# EAGLE schematic M8317E (EAGLE 6.6.0)

## Sheet 1 of 2
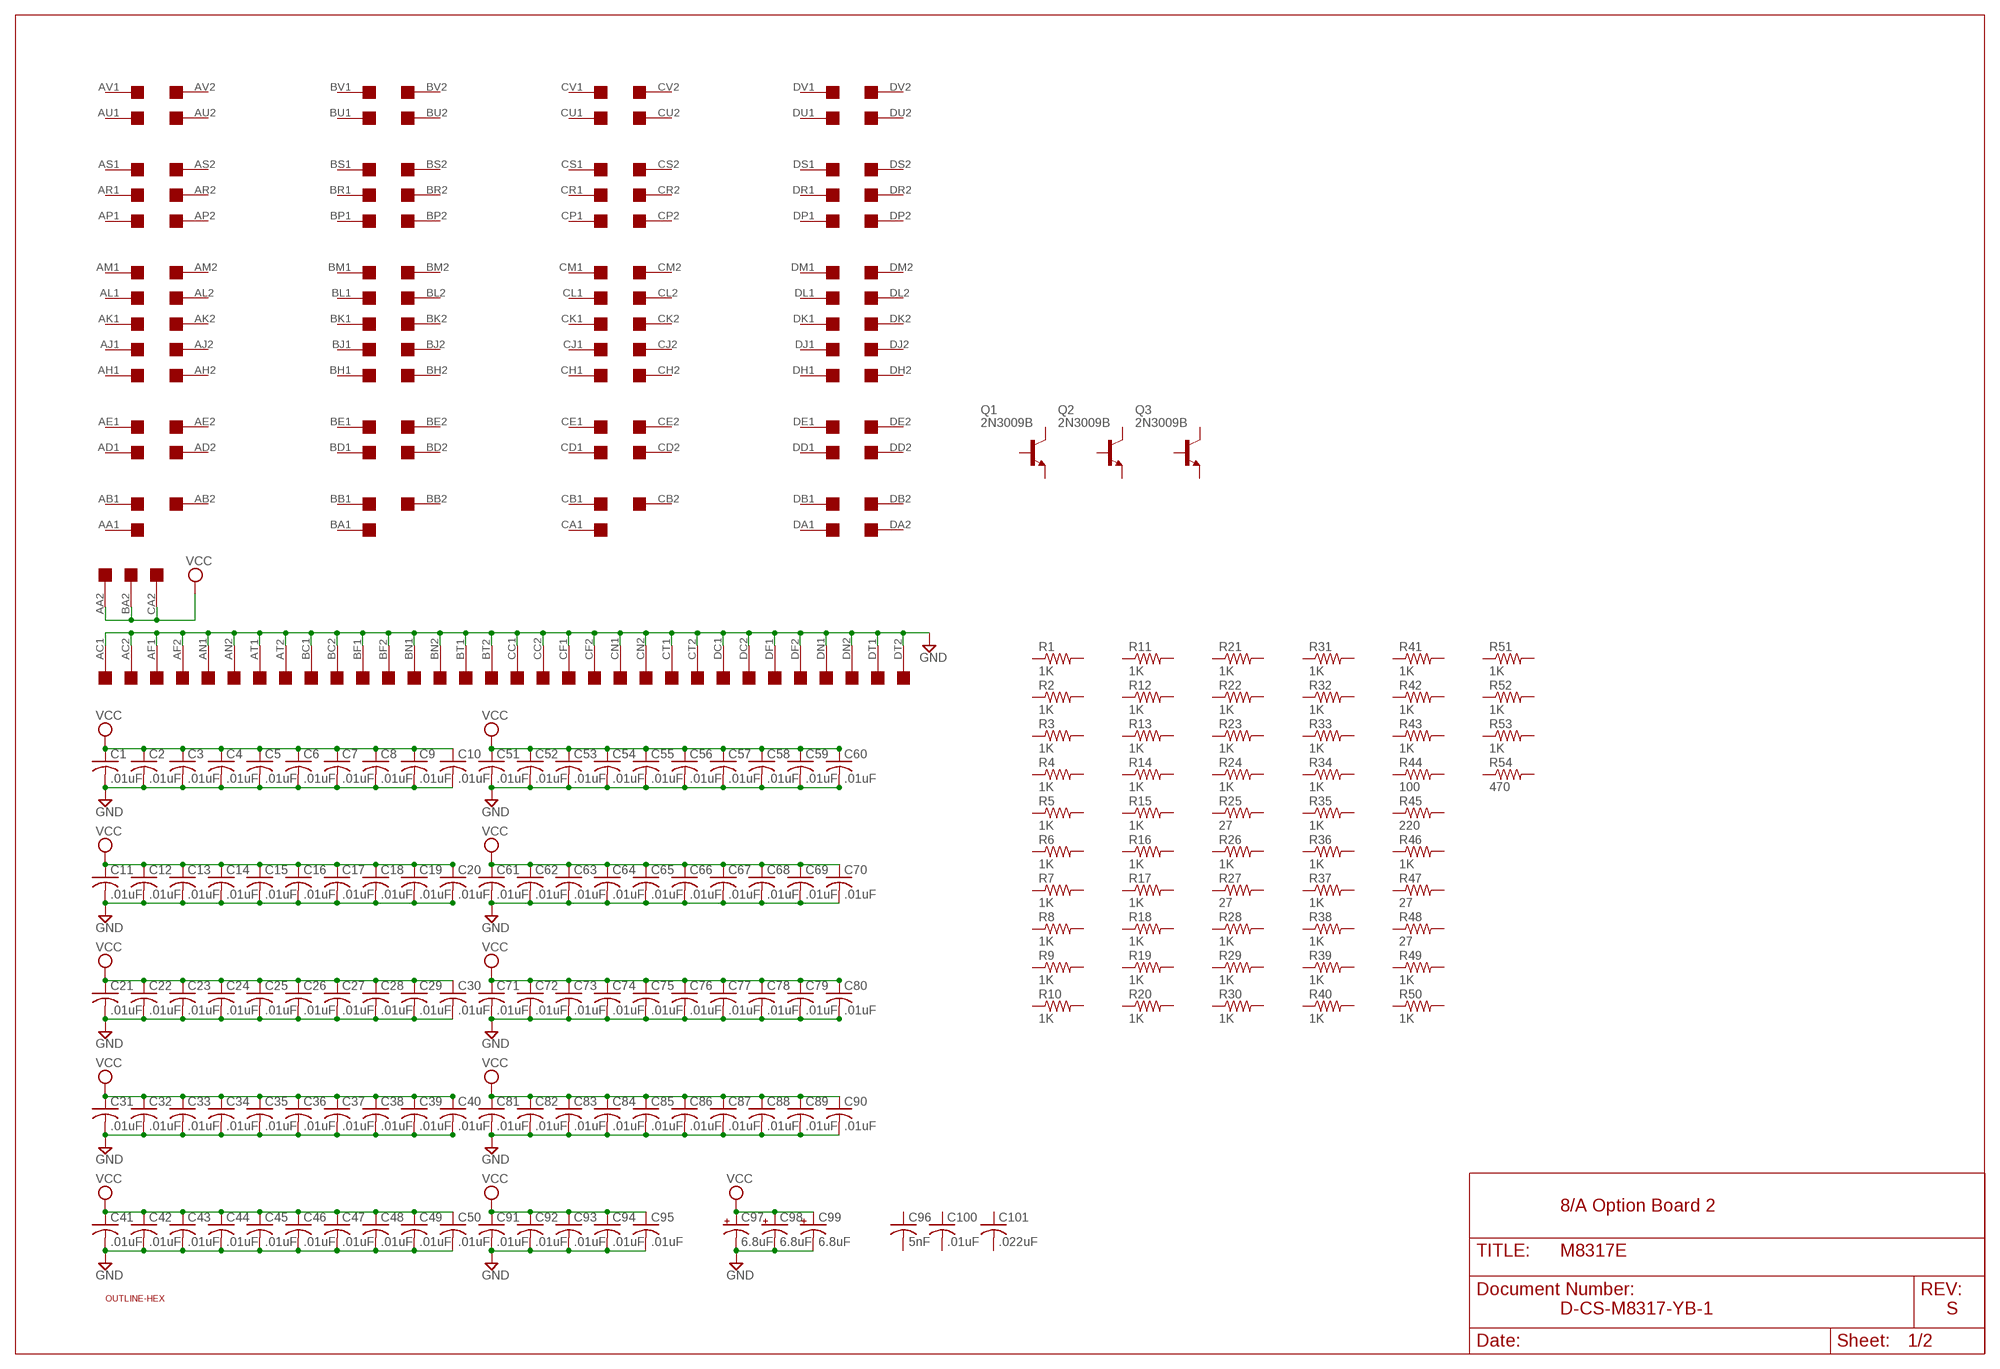
[diagram p0: schematic, sheet 1]

### Parts
C1  .01uF  C-US  [C063-025X075]
C2  .01uF  C-US  [C063-025X075]
C3  .01uF  C-US  [C063-025X075]
C4  .01uF  C-US  [C063-025X075]
C5  .01uF  C-US  [C063-025X075]
C6  .01uF  C-US  [C063-025X075]
C7  .01uF  C-US  [C063-025X075]
C8  .01uF  C-US  [C063-025X075]
C9  .01uF  C-US  [C063-025X075]
C10  .01uF  C-US  [C063-025X075]
C11  .01uF  C-US  [C063-025X075]
C12  .01uF  C-US  [C063-025X075]
C13  .01uF  C-US  [C063-025X075]
C14  .01uF  C-US  [C063-025X075]
C15  .01uF  C-US  [C063-025X075]
C16  .01uF  C-US  [C063-025X075]
C17  .01uF  C-US  [C063-025X075]
C18  .01uF  C-US  [C063-025X075]
C19  .01uF  C-US  [C063-025X075]
C20  .01uF  C-US  [C063-025X075]
C21  .01uF  C-US  [C063-025X075]
C22  .01uF  C-US  [C063-025X075]
C23  .01uF  C-US  [C063-025X075]
C24  .01uF  C-US  [C063-025X075]
C25  .01uF  C-US  [C063-025X075]
C26  .01uF  C-US  [C063-025X075]
C27  .01uF  C-US  [C063-025X075]
C28  .01uF  C-US  [C063-025X075]
C29  .01uF  C-US  [C063-025X075]
C30  .01uF  C-US  [C063-025X075]
C31  .01uF  C-US  [C063-025X075]
C32  .01uF  C-US  [C063-025X075]
C33  .01uF  C-US  [C063-025X075]
C34  .01uF  C-US  [C063-025X075]
C35  .01uF  C-US  [C063-025X075]
C36  .01uF  C-US  [C063-025X075]
C37  .01uF  C-US  [C063-025X075]
C38  .01uF  C-US  [C063-025X075]
C39  .01uF  C-US  [C063-025X075]
C40  .01uF  C-US  [C063-025X075]
C41  .01uF  C-US  [C063-025X075]
C42  .01uF  C-US  [C063-025X075]
C43  .01uF  C-US  [C063-025X075]
C44  .01uF  C-US  [C063-025X075]
C45  .01uF  C-US  [C063-025X075]
C46  .01uF  C-US  [C063-025X075]
C47  .01uF  C-US  [C063-025X075]
C48  .01uF  C-US  [C063-025X075]
C49  .01uF  C-US  [C063-025X075]
C50  .01uF  C-US  [C063-025X075]
C51  .01uF  C-US  [C063-025X075]
C52  .01uF  C-US  [C063-025X075]
C53  .01uF  C-US  [C063-025X075]
C54  .01uF  C-US  [C063-025X075]
C55  .01uF  C-US  [C063-025X075]
C56  .01uF  C-US  [C063-025X075]
C57  .01uF  C-US  [C063-025X075]
C58  .01uF  C-US  [C063-025X075]
C59  .01uF  C-US  [C063-025X075]
C60  .01uF  C-US  [C063-025X075]
C61  .01uF  C-US  [C063-025X075]
C62  .01uF  C-US  [C063-025X075]
C63  .01uF  C-US  [C063-025X075]
C64  .01uF  C-US  [C063-025X075]
C65  .01uF  C-US  [C063-025X075]
C66  .01uF  C-US  [C063-025X075]
C67  .01uF  C-US  [C063-025X075]
C68  .01uF  C-US  [C063-025X075]
C69  .01uF  C-US  [C063-025X075]
C70  .01uF  C-US  [C063-025X075]
C71  .01uF  C-US  [C063-025X075]
C72  .01uF  C-US  [C063-025X075]
C73  .01uF  C-US  [C063-025X075]
C74  .01uF  C-US  [C063-025X075]
C75  .01uF  C-US  [C063-025X075]
C76  .01uF  C-US  [C063-025X075]
C77  .01uF  C-US  [C063-025X075]
C78  .01uF  C-US  [C063-025X075]
C79  .01uF  C-US  [C063-025X075]
C80  .01uF  C-US  [C063-025X075]
C81  .01uF  C-US  [C063-025X075]
C82  .01uF  C-US  [C063-025X075]
C83  .01uF  C-US  [C063-025X075]
C84  .01uF  C-US  [C063-025X075]
C85  .01uF  C-US  [C063-025X075]
C86  .01uF  C-US  [C063-025X075]
C87  .01uF  C-US  [C063-025X075]
C88  .01uF  C-US  [C063-025X075]
C89  .01uF  C-US  [C063-025X075]
C90  .01uF  C-US  [C063-025X075]
C91  .01uF  C-US  [C063-025X075]
C92  .01uF  C-US  [C063-025X075]
C93  .01uF  C-US  [C063-025X075]
C94  .01uF  C-US  [C063-025X075]
C95  .01uF  C-US  [C063-025X075]
C96  5nF  C-US  [C063-025X075]
C97  6.8uF  CPOL-USE20-8AXIAL  [E12-8]
C98  6.8uF  CPOL-USE20-8AXIAL  [E12-8]
C99  6.8uF  CPOL-USE20-8AXIAL  [E12-8]
C100  .01uF  C-US  [C063-025X075]
C101  .022uF  C-US  [C063-025X075]
Q1  2N3009B  -NPN-TO5  [TO5]
Q2  2N3009B  -NPN-TO5  [TO5]
Q3  2N3009B  -NPN-TO5  [TO5]
R1  1K  R-US_0207/10  [0207/10]
R2  1K  R-US_0207/10  [0207/10]
R3  1K  R-US_0207/10  [0207/10]
R4  1K  R-US_0207/10  [0207/10]
R5  1K  R-US_0207/10  [0207/10]
R6  1K  R-US_0207/10  [0207/10]
R7  1K  R-US_0207/10  [0207/10]
R8  1K  R-US_0207/10  [0207/10]
R9  1K  R-US_0207/10  [0207/10]
R10  1K  R-US_0207/10  [0207/10]
R11  1K  R-US_0207/10  [0207/10]
R12  1K  R-US_0207/10  [0207/10]
R13  1K  R-US_0207/10  [0207/10]
R14  1K  R-US_0207/10  [0207/10]
R15  1K  R-US_0207/10  [0207/10]
R16  1K  R-US_0207/10  [0207/10]
R17  1K  R-US_0207/10  [0207/10]
R18  1K  R-US_0207/10  [0207/10]
R19  1K  R-US_0207/10  [0207/10]
R20  1K  R-US_0207/10  [0207/10]
R21  1K  R-US_0207/10  [0207/10]
R22  1K  R-US_0207/10  [0207/10]
R23  1K  R-US_0207/10  [0207/10]
R24  1K  R-US_0207/10  [0207/10]
R25  27  R-US_0207/10  [0207/10]
R26  1K  R-US_0207/10  [0207/10]
R27  27  R-US_0207/10  [0207/10]
R28  1K  R-US_0207/10  [0207/10]
R29  1K  R-US_0207/10  [0207/10]
R30  1K  R-US_0207/10  [0207/10]
R31  1K  R-US_0207/10  [0207/10]
R32  1K  R-US_0207/10  [0207/10]
R33  1K  R-US_0207/10  [0207/10]
R34  1K  R-US_0207/10  [0207/10]
R35  1K  R-US_0207/10  [0207/10]
R36  1K  R-US_0207/10  [0207/10]
R37  1K  R-US_0207/10  [0207/10]
R38  1K  R-US_0207/10  [0207/10]
R39  1K  R-US_0207/10  [0207/10]
R40  1K  R-US_0207/10  [0207/10]
R41  1K  R-US_0207/10  [0207/10]
R42  1K  R-US_0207/10  [0207/10]
R43  1K  R-US_0207/10  [0207/10]
R44  100  R-US_0207/10  [0207/10]
R45  220  R-US_0207/10  [0207/10]
R46  1K  R-US_0207/10  [0207/10]
R47  27  R-US_0207/10  [0207/10]
R48  27  R-US_0207/10  [0207/10]
R49  1K  R-US_0207/10  [0207/10]
R50  1K  R-US_0207/10  [0207/10]
R51  1K  R-US_0207/10  [0207/10]
R52  1K  R-US_0207/10  [0207/10]
R53  1K  R-US_0207/10  [0207/10]
R54  470  R-US_0207/10  [0207/10]
U$1  HEX  [EDGE-CON12]
U$2  OUTLINE-HEX  [HEX-HEIGHT]

### Nets
GND: C1.2 C2.2 C3.2 C4.2 C5.2 C6.2 C7.2 C8.2 C9.2 C10.2 C11.2 C12.2 C13.2 C14.2 C15.2 C16.2 C17.2 C18.2 C19.2 C20.2 C21.2 C22.2 C23.2 C24.2 C25.2 C26.2 C27.2 C28.2 C29.2 C30.2 C31.2 C32.2 C33.2 C34.2 C35.2 C36.2 C37.2 C38.2 C39.2 C40.2 C41.2 C42.2 C43.2 C44.2 C45.2 C46.2 C47.2 C48.2 C49.2 C50.2 C51.2 C52.2 C53.2 C54.2 C55.2 C56.2 C57.2 C58.2 C59.2 C60.2 C61.2 C62.2 C63.2 C64.2 C65.2 C66.2 C67.2 C68.2 C69.2 C70.2 C71.2 C72.2 C73.2 C74.2 C75.2 C76.2 C77.2 C78.2 C79.2 C80.2 C81.2 C82.2 C83.2 C84.2 C85.2 C86.2 C87.2 C88.2 C89.2 C90.2 C91.2 C92.2 C93.2 C94.2 C95.2 C97.- C98.- C99.- U$1.AC1 U$1.AC2 U$1.AF1 U$1.AF2 U$1.AN1 U$1.AN2 U$1.AT1 U$1.AT2 U$1.BC1 U$1.BC2 U$1.BF1 U$1.BF2 U$1.BN1 U$1.BN2 U$1.BT1 U$1.BT2 U$1.CC1 U$1.CC2 U$1.CF1 U$1.CF2 U$1.CN1 U$1.CN2 U$1.CT1 U$1.CT2 U$1.DC1 U$1.DC2 U$1.DF1 U$1.DF2 U$1.DN1 U$1.DN2 U$1.DT1 U$1.DT2
VCC: C1.1 C2.1 C3.1 C4.1 C5.1 C6.1 C7.1 C8.1 C9.1 C10.1 C11.1 C12.1 C13.1 C14.1 C15.1 C16.1 C17.1 C18.1 C19.1 C20.1 C21.1 C22.1 C23.1 C24.1 C25.1 C26.1 C27.1 C28.1 C29.1 C30.1 C31.1 C32.1 C33.1 C34.1 C35.1 C36.1 C37.1 C38.1 C39.1 C40.1 C41.1 C42.1 C43.1 C44.1 C45.1 C46.1 C47.1 C48.1 C49.1 C50.1 C51.1 C52.1 C53.1 C54.1 C55.1 C56.1 C57.1 C58.1 C59.1 C60.1 C61.1 C62.1 C63.1 C64.1 C65.1 C66.1 C67.1 C68.1 C69.1 C70.1 C71.1 C72.1 C73.1 C74.1 C75.1 C76.1 C77.1 C78.1 C79.1 C80.1 C81.1 C82.1 C83.1 C84.1 C85.1 C86.1 C87.1 C88.1 C89.1 C90.1 C91.1 C92.1 C93.1 C94.1 C95.1 C97.+ C98.+ C99.+ U$1.AA2 U$1.BA2 U$1.CA2
Unconnected: C96.1 C96.2 C100.1 C100.2 C101.1 C101.2 Q1.1(E) Q1.2(B) Q1.3(C) Q2.1(E) Q2.2(B) Q2.3(C) Q3.1(E) Q3.2(B) Q3.3(C) R1.1 R1.2 R2.1 R2.2 R3.1 R3.2 R4.1 R4.2 R5.1 R5.2 R6.1 R6.2 R7.1 R7.2 R8.1 R8.2 R9.1 R9.2 R10.1 R10.2 R11.1 R11.2 R12.1 R12.2 R13.1 R13.2 R14.1 R14.2 R15.1 R15.2 R16.1 R16.2 R17.1 R17.2 R18.1 R18.2 R19.1 R19.2 R20.1 R20.2 R21.1 R21.2 R22.1 R22.2 R23.1 R23.2 R24.1 R24.2 R25.1 R25.2 R26.1 R26.2 R27.1 R27.2 R28.1 R28.2 R29.1 R29.2 R30.1 R30.2 R31.1 R31.2 R32.1 R32.2 R33.1 R33.2 R34.1 R34.2 R35.1 R35.2 R36.1 R36.2 R37.1 R37.2 R38.1 R38.2 R39.1 R39.2 R40.1 R40.2 R41.1 R41.2 R42.1 R42.2 R43.1 R43.2 R44.1 R44.2 R45.1 R45.2 R46.1 R46.2 R47.1 R47.2 R48.1 R48.2 R49.1 R49.2 R50.1 R50.2 R51.1 R51.2 R52.1 R52.2 R53.1 R53.2 R54.1 R54.2 U$1.AA1 U$1.AB1 U$1.AB2 U$1.AD1 U$1.AD2 U$1.AE1 U$1.AE2 U$1.AH1 U$1.AH2 U$1.AJ1 U$1.AJ2 U$1.AK1 U$1.AK2 U$1.AL1 U$1.AL2 U$1.AM1 U$1.AM2 U$1.AP1 U$1.AP2 U$1.AR1 U$1.AR2 U$1.AS1 U$1.AS2 U$1.AU1 U$1.AU2 U$1.AV1 U$1.AV2 U$1.BA1 U$1.BB1 U$1.BB2 U$1.BD1 U$1.BD2 U$1.BE1 U$1.BE2 U$1.BH1 U$1.BH2 U$1.BJ1 U$1.BJ2 U$1.BK1 U$1.BK2 U$1.BL1 U$1.BL2 U$1.BM1 U$1.BM2 U$1.BP1 U$1.BP2 U$1.BR1 U$1.BR2 U$1.BS1 U$1.BS2 U$1.BU1 U$1.BU2 U$1.BV1 U$1.BV2 U$1.CA1 U$1.CB1 U$1.CB2 U$1.CD1 U$1.CD2 U$1.CE1 U$1.CE2 U$1.CH1 U$1.CH2 U$1.CJ1 U$1.CJ2 U$1.CK1 U$1.CK2 U$1.CL1 U$1.CL2 U$1.CM1 U$1.CM2 U$1.CP1 U$1.CP2 U$1.CR1 U$1.CR2 U$1.CS1 U$1.CS2 U$1.CU1 U$1.CU2 U$1.CV1 U$1.CV2 U$1.DA1 U$1.DA2 U$1.DB1 U$1.DB2 U$1.DD1 U$1.DD2 U$1.DE1 U$1.DE2 U$1.DH1 U$1.DH2 U$1.DJ1 U$1.DJ2 U$1.DK1 U$1.DK2 U$1.DL1 U$1.DL2 U$1.DM1 U$1.DM2 U$1.DP1 U$1.DP2 U$1.DR1 U$1.DR2 U$1.DS1 U$1.DS2 U$1.DU1 U$1.DU2 U$1.DV1 U$1.DV2 U$1.EA1 U$1.EA2 U$1.EB1 U$1.EB2 U$1.EC1 U$1.EC2 U$1.ED1 U$1.ED2 U$1.EE1 U$1.EE2 U$1.EF1 U$1.EF2 U$1.EH1 U$1.EH2 U$1.EJ1 U$1.EJ2 U$1.EK1 U$1.EK2 U$1.EL1 U$1.EL2 U$1.EM1 U$1.EM2 U$1.EN1 U$1.EN2 U$1.EP1 U$1.EP2 U$1.ER1 U$1.ER2 U$1.ES1 U$1.ES2 U$1.ET1 U$1.ET2 U$1.EU1 U$1.EU2 U$1.EV1 U$1.EV2 U$1.FA1 U$1.FA2 U$1.FB1 U$1.FB2 U$1.FC1 U$1.FC2 U$1.FD1 U$1.FD2 U$1.FE1 U$1.FE2 U$1.FF1 U$1.FF2 U$1.FH1 U$1.FH2 U$1.FJ1 U$1.FJ2 U$1.FK1 U$1.FK2 U$1.FL1 U$1.FL2 U$1.FM1 U$1.FM2 U$1.FN1 U$1.FN2 U$1.FP1 U$1.FP2 U$1.FR1 U$1.FR2 U$1.FS1 U$1.FS2 U$1.FT1 U$1.FT2 U$1.FU1 U$1.FU2 U$1.FV1 U$1.FV2

### Notes on the sheet
- 8/A Option Board 2
- D-CS-M8317-YB-1 | S

## Sheet 2 of 2
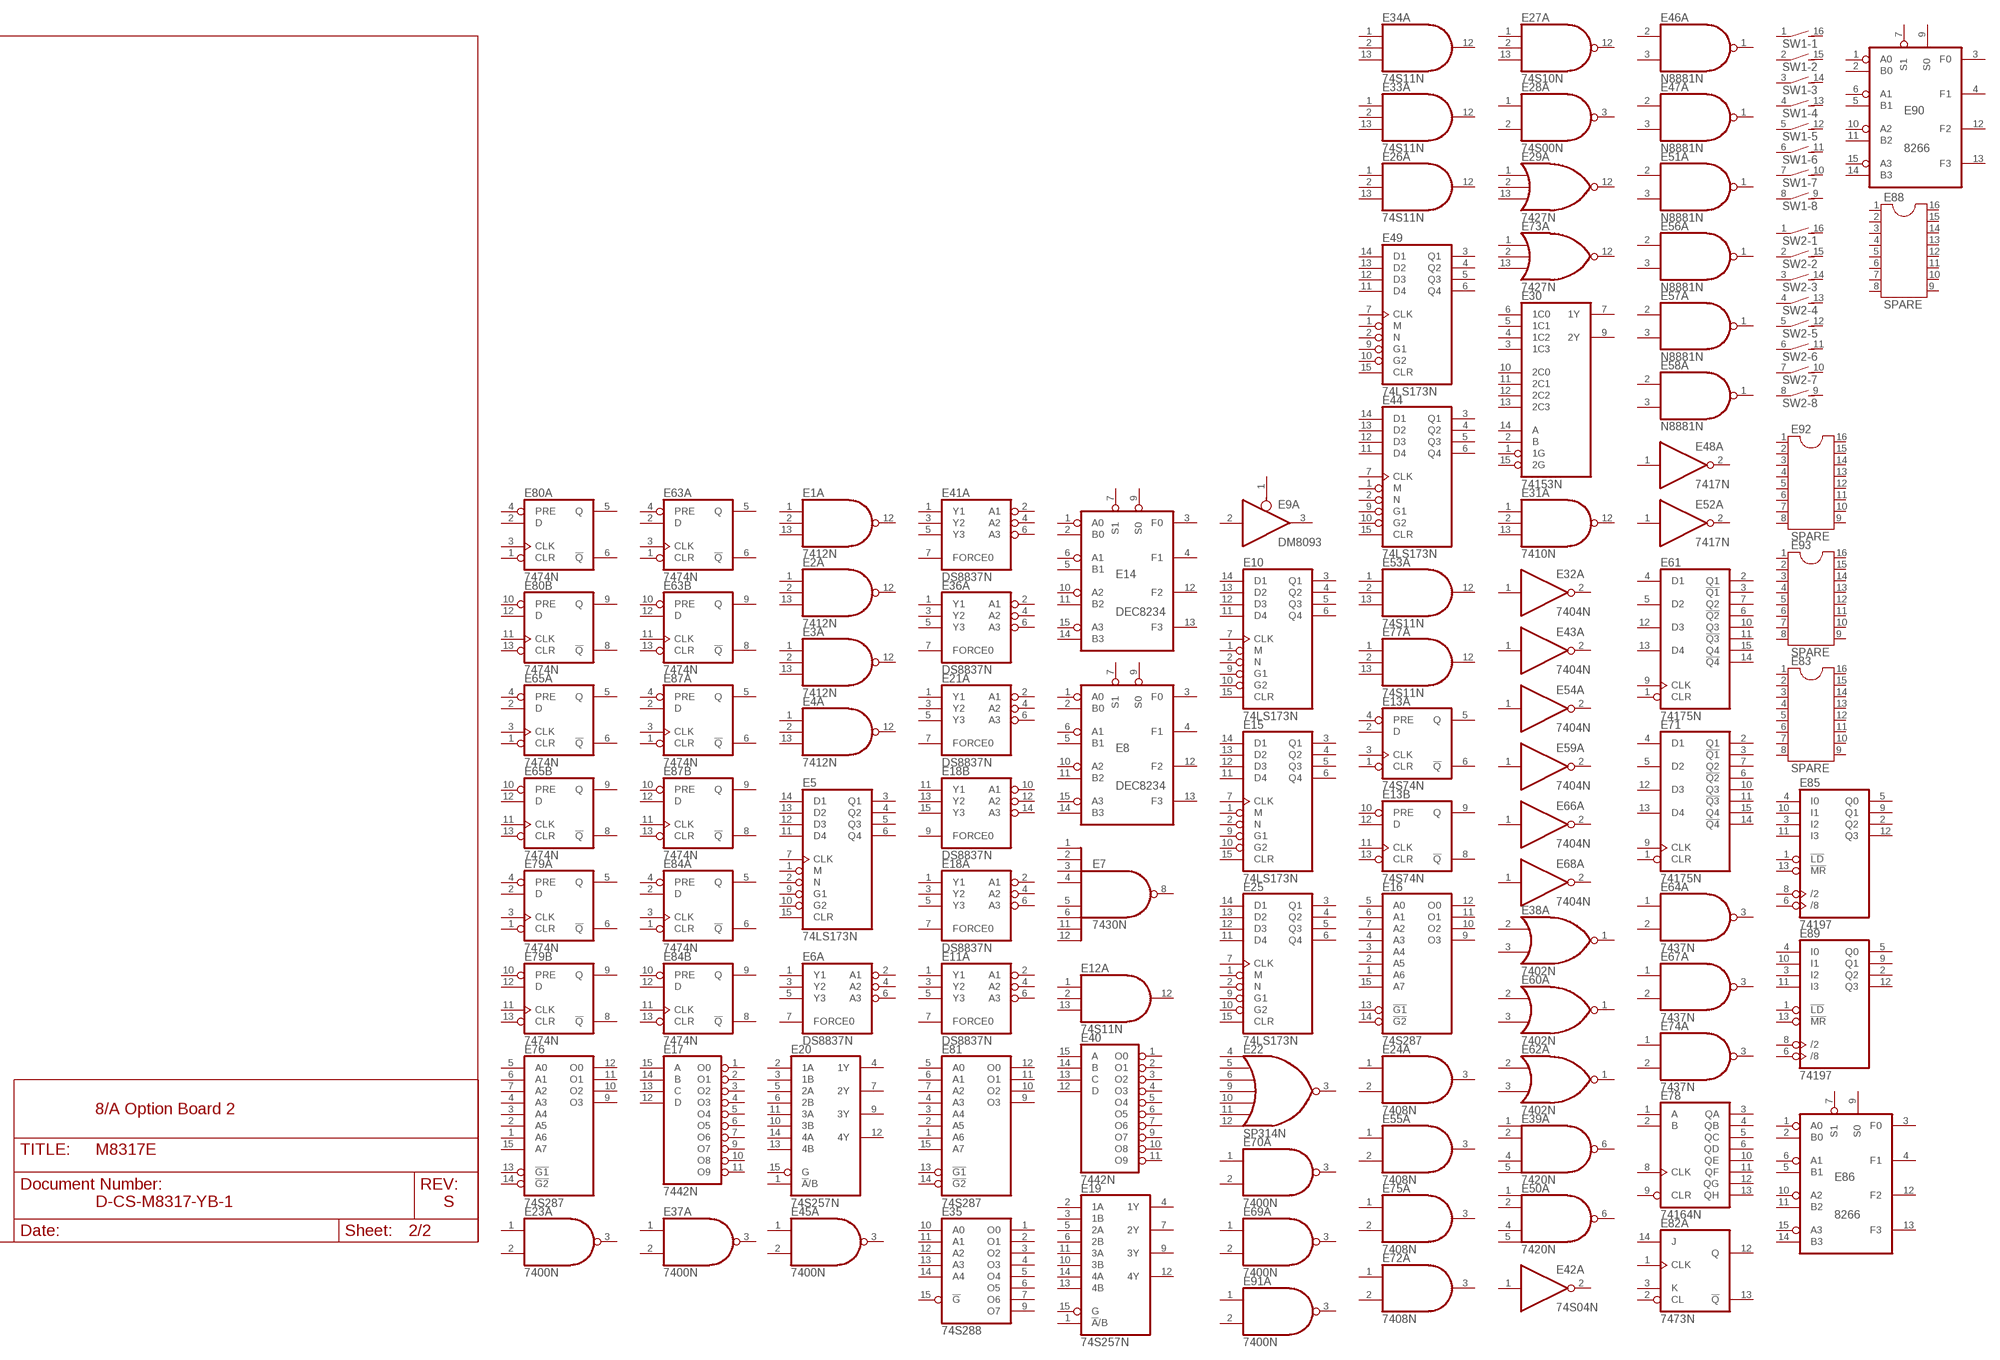
[diagram p1: schematic, sheet 2]

### Parts
E1  7412N  [DIL14]
E2  7412N  [DIL14]
E3  7412N  [DIL14]
E4  7412N  [DIL14]
E5  74LS173N  [DIL16]
E6  DS8837N  [DIL16]
E7  7430N  [DIL14]
E8  DEC8234  DEC8235  [DIL16]
E9  DM8093  74125N  [DIL14]
E10  74LS173N  [DIL16]
E11  DS8837N  [DIL16]
E12  74S11N  [DIL14]
E13  74S74N  [DIL14]
E14  DEC8234  DEC8235  [DIL16]
E15  74LS173N  [DIL16]
E16  74S287  [DIL16]
E17  7442N  74LS42N  [DIL16]
E18  DS8837N  [DIL16]
E19  74S257N  [DIL16]
E20  74S257N  [DIL16]
E21  DS8837N  [DIL16]
E22  SP314N  [DIL14]
E23  7400N  [DIL14]
E24  7408N  74S08N  [DIL14]
E25  74LS173N  [DIL16]
E26  74S11N  [DIL14]
E27  74S10N  [DIL14]
E28  74S00N  7400N  [DIL14]
E29  7427N  74LS27N  [DIL14]
E30  74153N  74S153N  [DIL16]
E31  7410N  74S10N  [DIL14]
E32  7404N  [DIL14]
E33  74S11N  [DIL14]
E34  74S11N  [DIL14]
E35  74S288  [DIL16]
E36  DS8837N  [DIL16]
E37  7400N  [DIL14]
E38  7402N  [DIL14]
E39  7420N  [DIL14]
E40  7442N  74LS42N  [DIL16]
E41  DS8837N  [DIL16]
E42  74S04N  7404N  [DIL14]
E43  7404N  [DIL14]
E44  74LS173N  [DIL16]
E45  7400N  [DIL14]
E46  N8881N  [DIL14]
E47  N8881N  [DIL14]
E48  7417N  [DIL14]
E49  74LS173N  [DIL16]
E50  7420N  [DIL14]
E51  N8881N  [DIL14]
E52  7417N  [DIL14]
E53  74S11N  [DIL14]
E54  7404N  [DIL14]
E55  7408N  74S08N  [DIL14]
E56  N8881N  [DIL14]
E57  N8881N  [DIL14]
E58  N8881N  [DIL14]
E59  7404N  [DIL14]
E60  7402N  [DIL14]
E61  74175N  [DIL16]
E62  7402N  [DIL14]
E63  7474N  74S74N  [DIL14]
E64  7437N  [DIL14]
E65  7474N  74S74N  [DIL14]
E66  7404N  [DIL14]
E67  7437N  [DIL14]
E68  7404N  [DIL14]
E69  7400N  [DIL14]
E70  7400N  [DIL14]
E71  74175N  [DIL16]
E72  7408N  74S08N  [DIL14]
E73  7427N  74LS27N  [DIL14]
E74  7437N  [DIL14]
E75  7408N  74S08N  [DIL14]
E76  74S287  [DIL16]
E77  74S11N  [DIL14]
E78  74164N  [DIL14]
E79  7474N  74S74N  [DIL14]
E80  7474N  74S74N  [DIL14]
E81  74S287  [DIL16]
E82  7473N  74LS73N  [DIL14]
E83  SPARE  DIL16S  [SOCKET-16]
E84  7474N  74S74N  [DIL14]
E85  74197  74LS197  [DIL14]
E86  8266  [DIL16]
E87  7474N  74S74N  [DIL14]
E88  SPARE  DIL16S  [SOCKET-16]
E89  74197  74LS197  [DIL14]
E90  8266  [DIL16]
E91  7400N  [DIL14]
E92  SPARE  DIL16S  [SOCKET-16]
E93  SPARE  DIL16S  [SOCKET-16]
SW1  DIP08S  [DIP08S]
SW2  DIP08S  [DIP08S]
Unconnected: E1.1(A:I0) E1.2(A:I1) E1.3(B:I0) E1.4(B:I1) E1.5(B:I2) E1.6(B:O) E1.8(C:O) E1.9(C:I0) E1.10(C:I1) E1.11(C:I2) E1.12(A:O) E1.13(A:I2) E2.1(A:I0) E2.2(A:I1) E2.3(B:I0) E2.4(B:I1) E2.5(B:I2) E2.6(B:O) E2.8(C:O) E2.9(C:I0) E2.10(C:I1) E2.11(C:I2) E2.12(A:O) E2.13(A:I2) E3.1(A:I0) E3.2(A:I1) E3.3(B:I0) E3.4(B:I1) E3.5(B:I2) E3.6(B:O) E3.8(C:O) E3.9(C:I0) E3.10(C:I1) E3.11(C:I2) E3.12(A:O) E3.13(A:I2) E4.1(A:I0) E4.2(A:I1) E4.3(B:I0) E4.4(B:I1) E4.5(B:I2) E4.6(B:O) E4.8(C:O) E4.9(C:I0) E4.10(C:I1) E4.11(C:I2) E4.12(A:O) E4.13(A:I2) E5.1(M) E5.2(N) E5.3(Q1) E5.4(Q2) E5.5(Q3) E5.6(Q4) E5.7(CLK) E5.9(G1) E5.10(G2) E5.11(D4) E5.12(D3) E5.13(D2) E5.14(D1) E5.15(CLR) E6.1(A:Y1) E6.2(A:A1) E6.3(A:Y2) E6.4(A:A2) E6.5(A:Y3) E6.6(A:A3) E6.7(A:FORCE0) E6.9(B:FORCE0) E6.10(B:A1) E6.11(B:Y1) E6.12(B:A2) E6.13(B:Y2) E6.14(B:A3) E6.15(B:Y3) E7.1(I0) E7.2(I1) E7.3(I2) E7.4(I3) E7.5(I4) E7.6(I5) E7.8(O) E7.9(P) E7.10(P) E7.11(I6) E7.12(I7) E7.13(P) E8.1(A0) E8.2(B0) E8.3(F0) E8.4(F1) E8.5(B1) E8.6(A1) E8.7(S1) E8.9(S0) E8.10(A2) E8.11(B2) E8.12(F2) E8.13(F3) E8.14(B3) E8.15(A3) E9.1(A:OE) E9.2(A:I) E9.3(A:O) E9.4(B:OE) E9.5(B:I) E9.6(B:O) E9.8(C:O) E9.9(C:I) E9.10(C:OE) E9.11(D:O) E9.12(D:I) E9.13(D:OE) E10.1(M) E10.2(N) E10.3(Q1) E10.4(Q2) E10.5(Q3) E10.6(Q4) E10.7(CLK) E10.9(G1) E10.10(G2) E10.11(D4) E10.12(D3) E10.13(D2) E10.14(D1) E10.15(CLR) E11.1(A:Y1) E11.2(A:A1) E11.3(A:Y2) E11.4(A:A2) E11.5(A:Y3) E11.6(A:A3) E11.7(A:FORCE0) E11.9(B:FORCE0) E11.10(B:A1) E11.11(B:Y1) E11.12(B:A2) E11.13(B:Y2) E11.14(B:A3) E11.15(B:Y3) E12.1(A:I0) E12.2(A:I1) E12.3(B:I0) E12.4(B:I1) E12.5(B:I2) E12.6(B:O) E12.8(C:O) E12.9(C:I0) E12.10(C:I1) E12.11(C:I2) E12.12(A:O) E12.13(A:I2) E13.1(A:CLR) E13.2(A:D) E13.3(A:CLK) E13.4(A:PRE) E13.5(A:Q) E13.6(A:!Q) E13.8(B:!Q) E13.9(B:Q) E13.10(B:PRE) E13.11(B:CLK) E13.12(B:D) E13.13(B:CLR) E14.1(A0) E14.2(B0) E14.3(F0) E14.4(F1) E14.5(B1) E14.6(A1) E14.7(S1) E14.9(S0) E14.10(A2) E14.11(B2) E14.12(F2) E14.13(F3) E14.14(B3) E14.15(A3) E15.1(M) E15.2(N) E15.3(Q1) E15.4(Q2) E15.5(Q3) E15.6(Q4) E15.7(CLK) E15.9(G1) E15.10(G2) E15.11(D4) E15.12(D3) E15.13(D2) E15.14(D1) E15.15(CLR) E16.1(A6) E16.2(A5) E16.3(A4) E16.4(A3) E16.5(A0) E16.6(A1) E16.7(A2) E16.9(O3) E16.10(O2) E16.11(O1) E16.12(O0) E16.13(!G1) E16.14(!G2) E16.15(A7) E17.1(O0) E17.2(O1) E17.3(O2) E17.4(O3) E17.5(O4) E17.6(O5) E17.7(O6) E17.9(O7) E17.10(O8) E17.11(O9) E17.12(D) E17.13(C) E17.14(B) E17.15(A) E18.1(A:Y1) E18.2(A:A1) E18.3(A:Y2) E18.4(A:A2) E18.5(A:Y3) E18.6(A:A3) E18.7(A:FORCE0) E18.9(B:FORCE0) E18.10(B:A1) E18.11(B:Y1) E18.12(B:A2) E18.13(B:Y2) E18.14(B:A3) E18.15(B:Y3) E19.1(!A!/B) E19.2(1A) E19.3(1B) E19.4(1Y) E19.5(2A) E19.6(2B) E19.7(2Y) E19.9(3Y) E19.10(3B) E19.11(3A) E19.12(4Y) E19.13(4B) E19.14(4A) E19.15(G) E20.1(!A!/B) E20.2(1A) E20.3(1B) E20.4(1Y) E20.5(2A) E20.6(2B) E20.7(2Y) E20.9(3Y) E20.10(3B) E20.11(3A) E20.12(4Y) E20.13(4B) E20.14(4A) E20.15(G) E21.1(A:Y1) E21.2(A:A1) E21.3(A:Y2) E21.4(A:A2) E21.5(A:Y3) E21.6(A:A3) E21.7(A:FORCE0) E21.9(B:FORCE0) E21.10(B:A1) E21.11(B:Y1) E21.12(B:A2) E21.13(B:Y2) E21.14(B:A3) E21.15(B:Y3) E22.3(O) E22.4(I0) E22.5(I1) E22.6(I2) E22.9(I3) E22.10(I4) E22.11(I5) E22.12(I6) E23.1(A:I0) E23.2(A:I1) E23.3(A:O) E23.4(B:I0) E23.5(B:I1) E23.6(B:O) E23.8(C:O) E23.9(C:I0) E23.10(C:I1) E23.11(D:O) E23.12(D:I0) E23.13(D:I1) E24.1(A:I0) E24.2(A:I1) E24.3(A:O) E24.4(B:I0) E24.5(B:I1) E24.6(B:O) E24.8(C:O) E24.9(C:I0) E24.10(C:I1) E24.11(D:O) E24.12(D:I0) E24.13(D:I1) E25.1(M) E25.2(N) E25.3(Q1) E25.4(Q2) E25.5(Q3) E25.6(Q4) E25.7(CLK) E25.9(G1) E25.10(G2) E25.11(D4) E25.12(D3) E25.13(D2) E25.14(D1) E25.15(CLR) E26.1(A:I0) E26.2(A:I1) E26.3(B:I0) E26.4(B:I1) E26.5(B:I2) E26.6(B:O) E26.8(C:O) E26.9(C:I0) E26.10(C:I1) E26.11(C:I2) E26.12(A:O) E26.13(A:I2) E27.1(A:I0) E27.2(A:I1) E27.3(B:I0) E27.4(B:I1) E27.5(B:I2) E27.6(B:O) E27.8(C:O) E27.9(C:I0) E27.10(C:I1) E27.11(C:I2) E27.12(A:O) E27.13(A:I2) E28.1(A:I0) E28.2(A:I1) E28.3(A:O) E28.4(B:I0) E28.5(B:I1) E28.6(B:O) E28.8(C:O) E28.9(C:I0) E28.10(C:I1) E28.11(D:O) E28.12(D:I0) E28.13(D:I1) E29.1(A:I0) E29.2(A:I1) E29.3(B:I0) E29.4(B:I1) E29.5(B:I2) E29.6(B:O) E29.8(C:O) E29.9(C:I0) E29.10(C:I1) E29.11(C:I2) E29.12(A:O) E29.13(A:I2) E30.1(1G) E30.2(B) E30.3(1C3) E30.4(1C2) E30.5(1C1) E30.6(1C0) E30.7(1Y) E30.9(2Y) E30.10(2C0) E30.11(2C1) E30.12(2C2) E30.13(2C3) E30.14(A) E30.15(2G) E31.1(A:I0) E31.2(A:I1) E31.3(B:I0) E31.4(B:I1) E31.5(B:I2) E31.6(B:O) E31.8(C:O) E31.9(C:I0) E31.10(C:I1) E31.11(C:I2) E31.12(A:O) E31.13(A:I2) E32.1(A:I) E32.2(A:O) E32.3(B:I) E32.4(B:O) E32.5(C:I) E32.6(C:O) E32.8(D:O) E32.9(D:I) E32.10(E:O) E32.11(E:I) E32.12(F:O) E32.13(F:I) E33.1(A:I0) E33.2(A:I1) E33.3(B:I0) E33.4(B:I1) E33.5(B:I2) E33.6(B:O) E33.8(C:O) E33.9(C:I0) E33.10(C:I1) E33.11(C:I2) E33.12(A:O) E33.13(A:I2) E34.1(A:I0) E34.2(A:I1) E34.3(B:I0) E34.4(B:I1) E34.5(B:I2) E34.6(B:O) E34.8(C:O) E34.9(C:I0) E34.10(C:I1) E34.11(C:I2) E34.12(A:O) E34.13(A:I2) E35.1(O0) E35.2(O1) E35.3(O2) E35.4(O3) E35.5(O4) E35.6(O5) E35.7(O6) E35.9(O7) E35.10(A0) E35.11(A1) E35.12(A2) E35.13(A3) E35.14(A4) E35.15(!G) E36.1(A:Y1) E36.2(A:A1) E36.3(A:Y2) E36.4(A:A2) E36.5(A:Y3) E36.6(A:A3) E36.7(A:FORCE0) E36.9(B:FORCE0) E36.10(B:A1) E36.11(B:Y1) E36.12(B:A2) E36.13(B:Y2) E36.14(B:A3) E36.15(B:Y3) E37.1(A:I0) E37.2(A:I1) E37.3(A:O) E37.4(B:I0) E37.5(B:I1) E37.6(B:O) E37.8(C:O) E37.9(C:I0) E37.10(C:I1) E37.11(D:O) E37.12(D:I0) E37.13(D:I1) E38.1(A:O) E38.2(A:I0) E38.3(A:I1) E38.4(B:O) E38.5(B:I0) E38.6(B:I1) E38.8(C:I0) E38.9(C:I1) E38.10(C:O) E38.11(D:I0) E38.12(D:I1) E38.13(D:O) E39.1(A:I0) E39.2(A:I1) E39.3(3:NC) E39.4(A:I2) E39.5(A:I3) E39.6(A:O) E39.8(B:O) E39.9(B:I0) E39.10(B:I1) E39.11(11:NC) E39.12(B:I2) E39.13(B:I3) E40.1(O0) E40.2(O1) E40.3(O2) E40.4(O3) E40.5(O4) E40.6(O5) E40.7(O6) E40.9(O7) E40.10(O8) E40.11(O9) E40.12(D) E40.13(C) E40.14(B) E40.15(A) E41.1(A:Y1) E41.2(A:A1) E41.3(A:Y2) E41.4(A:A2) E41.5(A:Y3) E41.6(A:A3) E41.7(A:FORCE0) E41.9(B:FORCE0) E41.10(B:A1) E41.11(B:Y1) E41.12(B:A2) E41.13(B:Y2) E41.14(B:A3) E41.15(B:Y3) E42.1(A:I) E42.2(A:O) E42.3(B:I) E42.4(B:O) E42.5(C:I) E42.6(C:O) E42.8(D:O) E42.9(D:I) E42.10(E:O) E42.11(E:I) E42.12(F:O) E42.13(F:I) E43.1(A:I) E43.2(A:O) E43.3(B:I) E43.4(B:O) E43.5(C:I) E43.6(C:O) E43.8(D:O) E43.9(D:I) E43.10(E:O) E43.11(E:I) E43.12(F:O) E43.13(F:I) E44.1(M) E44.2(N) E44.3(Q1) E44.4(Q2) E44.5(Q3) E44.6(Q4) E44.7(CLK) E44.9(G1) E44.10(G2) E44.11(D4) E44.12(D3) E44.13(D2) E44.14(D1) E44.15(CLR) E45.1(A:I0) E45.2(A:I1) E45.3(A:O) E45.4(B:I0) E45.5(B:I1) E45.6(B:O) E45.8(C:O) E45.9(C:I0) E45.10(C:I1) E45.11(D:O) E45.12(D:I0) E45.13(D:I1) E46.1(A:O) E46.2(A:I0) E46.3(A:I1) E46.4(B:O) E46.5(B:I0) E46.6(B:I1) E46.8(C:I0) E46.9(C:I1) E46.10(C:O) E46.11(D:I0) E46.12(D:I1) E46.13(D:O) E47.1(A:O) E47.2(A:I0) E47.3(A:I1) E47.4(B:O) E47.5(B:I0) E47.6(B:I1) E47.8(C:I0) E47.9(C:I1) E47.10(C:O) E47.11(D:I0) E47.12(D:I1) E47.13(D:O) E48.1(A:I) E48.2(A:O) E48.3(B:I) E48.4(B:O) E48.5(C:I) E48.6(C:O) E48.8(D:O) E48.9(D:I) E48.10(E:O) E48.11(E:I) E48.12(F:O) E48.13(F:I) E49.1(M) E49.2(N) E49.3(Q1) E49.4(Q2) E49.5(Q3) E49.6(Q4) E49.7(CLK) E49.9(G1) E49.10(G2) E49.11(D4) E49.12(D3) E49.13(D2) E49.14(D1) E49.15(CLR) E50.1(A:I0) E50.2(A:I1) E50.3(3:NC) E50.4(A:I2) E50.5(A:I3) E50.6(A:O) E50.8(B:O) E50.9(B:I0) E50.10(B:I1) E50.11(11:NC) E50.12(B:I2) E50.13(B:I3) E51.1(A:O) E51.2(A:I0) E51.3(A:I1) E51.4(B:O) E51.5(B:I0) E51.6(B:I1) E51.8(C:I0) E51.9(C:I1) E51.10(C:O) E51.11(D:I0) E51.12(D:I1) E51.13(D:O) E52.1(A:I) E52.2(A:O) E52.3(B:I) E52.4(B:O) E52.5(C:I) E52.6(C:O) E52.8(D:O) E52.9(D:I) E52.10(E:O) E52.11(E:I) E52.12(F:O) E52.13(F:I) E53.1(A:I0) E53.2(A:I1) E53.3(B:I0) E53.4(B:I1) E53.5(B:I2) E53.6(B:O) E53.8(C:O) E53.9(C:I0) E53.10(C:I1) E53.11(C:I2) E53.12(A:O) E53.13(A:I2) E54.1(A:I) E54.2(A:O) E54.3(B:I) E54.4(B:O) E54.5(C:I) E54.6(C:O) E54.8(D:O) E54.9(D:I) E54.10(E:O) E54.11(E:I) E54.12(F:O) E54.13(F:I) E55.1(A:I0) E55.2(A:I1) E55.3(A:O) E55.4(B:I0) E55.5(B:I1) E55.6(B:O) E55.8(C:O) E55.9(C:I0) E55.10(C:I1) E55.11(D:O) E55.12(D:I0) E55.13(D:I1) E56.1(A:O) E56.2(A:I0) E56.3(A:I1) E56.4(B:O) E56.5(B:I0) E56.6(B:I1) E56.8(C:I0) E56.9(C:I1) E56.10(C:O) E56.11(D:I0) E56.12(D:I1) E56.13(D:O) E57.1(A:O) E57.2(A:I0) E57.3(A:I1) E57.4(B:O) E57.5(B:I0) E57.6(B:I1) E57.8(C:I0) E57.9(C:I1) E57.10(C:O) E57.11(D:I0) E57.12(D:I1) E57.13(D:O) E58.1(A:O) E58.2(A:I0) E58.3(A:I1) E58.4(B:O) E58.5(B:I0) E58.6(B:I1) E58.8(C:I0) E58.9(C:I1) E58.10(C:O) E58.11(D:I0) E58.12(D:I1) E58.13(D:O) E59.1(A:I) E59.2(A:O) E59.3(B:I) E59.4(B:O) E59.5(C:I) E59.6(C:O) E59.8(D:O) E59.9(D:I) E59.10(E:O) E59.11(E:I) E59.12(F:O) E59.13(F:I) E60.1(A:O) E60.2(A:I0) E60.3(A:I1) E60.4(B:O) E60.5(B:I0) E60.6(B:I1) E60.8(C:I0) E60.9(C:I1) E60.10(C:O) E60.11(D:I0) E60.12(D:I1) E60.13(D:O) E61.1(CLR) E61.2(Q1) E61.3(!Q1) E61.4(D1) E61.5(D2) E61.6(!Q2) E61.7(Q2) E61.9(CLK) E61.10(Q3) E61.11(!Q3) E61.12(D3) E61.13(D4) E61.14(!Q4) E61.15(Q4) E62.1(A:O) E62.2(A:I0) E62.3(A:I1) E62.4(B:O) E62.5(B:I0) E62.6(B:I1) E62.8(C:I0) E62.9(C:I1) E62.10(C:O) E62.11(D:I0) E62.12(D:I1) E62.13(D:O) E63.1(A:CLR) E63.2(A:D) E63.3(A:CLK) E63.4(A:PRE) E63.5(A:Q) E63.6(A:!Q) E63.8(B:!Q) E63.9(B:Q) E63.10(B:PRE) E63.11(B:CLK) E63.12(B:D) E63.13(B:CLR) E64.1(A:I0) E64.2(A:I1) E64.3(A:O) E64.4(B:I0) E64.5(B:I1) E64.6(B:O) E64.8(C:O) E64.9(C:I0) E64.10(C:I1) E64.11(D:O) E64.12(D:I0) E64.13(D:I1) E65.1(A:CLR) E65.2(A:D) E65.3(A:CLK) E65.4(A:PRE) E65.5(A:Q) E65.6(A:!Q) E65.8(B:!Q) E65.9(B:Q) E65.10(B:PRE) E65.11(B:CLK) E65.12(B:D) E65.13(B:CLR) E66.1(A:I) E66.2(A:O) E66.3(B:I) E66.4(B:O) E66.5(C:I) E66.6(C:O) E66.8(D:O) E66.9(D:I) E66.10(E:O) E66.11(E:I) E66.12(F:O) E66.13(F:I) E67.1(A:I0) E67.2(A:I1) E67.3(A:O) E67.4(B:I0) E67.5(B:I1) E67.6(B:O) E67.8(C:O) E67.9(C:I0) E67.10(C:I1) E67.11(D:O) E67.12(D:I0) E67.13(D:I1) E68.1(A:I) E68.2(A:O) E68.3(B:I) E68.4(B:O) E68.5(C:I) E68.6(C:O) E68.8(D:O) E68.9(D:I) E68.10(E:O) E68.11(E:I) E68.12(F:O) E68.13(F:I) E69.1(A:I0) E69.2(A:I1) E69.3(A:O) E69.4(B:I0) E69.5(B:I1) E69.6(B:O) E69.8(C:O) E69.9(C:I0) E69.10(C:I1) E69.11(D:O) E69.12(D:I0) E69.13(D:I1) E70.1(A:I0) E70.2(A:I1) E70.3(A:O) E70.4(B:I0) E70.5(B:I1) E70.6(B:O) E70.8(C:O) E70.9(C:I0) E70.10(C:I1) E70.11(D:O) E70.12(D:I0) E70.13(D:I1) E71.1(CLR) E71.2(Q1) E71.3(!Q1) E71.4(D1) E71.5(D2) E71.6(!Q2) E71.7(Q2) E71.9(CLK) E71.10(Q3) E71.11(!Q3) E71.12(D3) E71.13(D4) E71.14(!Q4) E71.15(Q4) E72.1(A:I0) E72.2(A:I1) E72.3(A:O) E72.4(B:I0) E72.5(B:I1) E72.6(B:O) E72.8(C:O) E72.9(C:I0) E72.10(C:I1) E72.11(D:O) E72.12(D:I0) E72.13(D:I1) E73.1(A:I0) E73.2(A:I1) E73.3(B:I0) E73.4(B:I1) E73.5(B:I2) E73.6(B:O) E73.8(C:O) E73.9(C:I0) E73.10(C:I1) E73.11(C:I2) E73.12(A:O) E73.13(A:I2) E74.1(A:I0) E74.2(A:I1) E74.3(A:O) E74.4(B:I0) E74.5(B:I1) E74.6(B:O) E74.8(C:O) E74.9(C:I0) E74.10(C:I1) E74.11(D:O) E74.12(D:I0) E74.13(D:I1) E75.1(A:I0) E75.2(A:I1) E75.3(A:O) E75.4(B:I0) E75.5(B:I1) E75.6(B:O) E75.8(C:O) E75.9(C:I0) E75.10(C:I1) E75.11(D:O) E75.12(D:I0) E75.13(D:I1) E76.1(A6) E76.2(A5) E76.3(A4) E76.4(A3) E76.5(A0) E76.6(A1) E76.7(A2) E76.9(O3) E76.10(O2) E76.11(O1) E76.12(O0) E76.13(!G1) E76.14(!G2) E76.15(A7) E77.1(A:I0) E77.2(A:I1) E77.3(B:I0) E77.4(B:I1) E77.5(B:I2) E77.6(B:O) E77.8(C:O) E77.9(C:I0) E77.10(C:I1) E77.11(C:I2) E77.12(A:O) E77.13(A:I2) E78.1(A) E78.2(B) E78.3(QA) E78.4(QB) E78.5(QC) E78.6(QD) E78.8(CLK) E78.9(CLR) E78.10(QE) E78.11(QF) E78.12(QG) E78.13(QH) E79.1(A:CLR) E79.2(A:D) E79.3(A:CLK) E79.4(A:PRE) E79.5(A:Q) E79.6(A:!Q) E79.8(B:!Q) E79.9(B:Q) E79.10(B:PRE) E79.11(B:CLK) E79.12(B:D) E79.13(B:CLR) E80.1(A:CLR) E80.2(A:D) E80.3(A:CLK) E80.4(A:PRE) E80.5(A:Q) E80.6(A:!Q) E80.8(B:!Q) E80.9(B:Q) E80.10(B:PRE) E80.11(B:CLK) E80.12(B:D) E80.13(B:CLR) E81.1(A6) E81.2(A5) E81.3(A4) E81.4(A3) E81.5(A0) E81.6(A1) E81.7(A2) E81.9(O3) E81.10(O2) E81.11(O1) E81.12(O0) E81.13(!G1) E81.14(!G2) E81.15(A7) E82.1(A:CLK) E82.2(A:CL) E82.3(A:K) E82.5(B:CLK) E82.6(B:CL) E82.7(B:J) E82.8(B:!Q) E82.9(B:Q) E82.10(B:K) E82.12(A:Q) E82.13(A:!Q) E82.14(A:J) E83.1 E83.2 E83.3 E83.4 E83.5 E83.6 E83.7 E83.8 E83.9 E83.10 E83.11 E83.12 E83.13 E83.14 E83.15 E83.16 E84.1(A:CLR) E84.2(A:D) E84.3(A:CLK) E84.4(A:PRE) E84.5(A:Q) E84.6(A:!Q) E84.8(B:!Q) E84.9(B:Q) E84.10(B:PRE) E84.11(B:CLK) E84.12(B:D) E84.13(B:CLR) E85.1(!LD) E85.2(Q2) E85.3(I2) E85.4(I0) E85.5(Q0) E85.6(/8) E85.8(/2) E85.9(Q1) E85.10(I1) E85.11(I3) E85.12(Q3) E85.13(!MR) E86.1(A0) E86.2(B0) E86.3(F0) E86.4(F1) E86.5(B1) E86.6(A1) E86.7(S1) E86.9(S0) E86.10(A2) E86.11(B2) E86.12(F2) E86.13(F3) E86.14(B3) E86.15(A3) E87.1(A:CLR) E87.2(A:D) E87.3(A:CLK) E87.4(A:PRE) E87.5(A:Q) E87.6(A:!Q) E87.8(B:!Q) E87.9(B:Q) E87.10(B:PRE) E87.11(B:CLK) E87.12(B:D) E87.13(B:CLR) E88.1 E88.2 E88.3 E88.4 E88.5 E88.6 E88.7 E88.8 E88.9 E88.10 E88.11 E88.12 E88.13 E88.14 E88.15 E88.16 E89.1(!LD) E89.2(Q2) E89.3(I2) E89.4(I0) E89.5(Q0) E89.6(/8) E89.8(/2) E89.9(Q1) E89.10(I1) E89.11(I3) E89.12(Q3) E89.13(!MR) E90.1(A0) E90.2(B0) E90.3(F0) E90.4(F1) E90.5(B1) E90.6(A1) E90.7(S1) E90.9(S0) E90.10(A2) E90.11(B2) E90.12(F2) E90.13(F3) E90.14(B3) E90.15(A3) E91.1(A:I0) E91.2(A:I1) E91.3(A:O) E91.4(B:I0) E91.5(B:I1) E91.6(B:O) E91.8(C:O) E91.9(C:I0) E91.10(C:I1) E91.11(D:O) E91.12(D:I0) E91.13(D:I1) E92.1 E92.2 E92.3 E92.4 E92.5 E92.6 E92.7 E92.8 E92.9 E92.10 E92.11 E92.12 E92.13 E92.14 E92.15 E92.16 E93.1 E93.2 E93.3 E93.4 E93.5 E93.6 E93.7 E93.8 E93.9 E93.10 E93.11 E93.12 E93.13 E93.14 E93.15 E93.16 SW1.1 SW1.2 SW1.3 SW1.4 SW1.5 SW1.6 SW1.7 SW1.8 SW1.9 SW1.10 SW1.11 SW1.12 SW1.13 SW1.14 SW1.15 SW1.16 SW2.1 SW2.2 SW2.3 SW2.4 SW2.5 SW2.6 SW2.7 SW2.8 SW2.9 SW2.10 SW2.11 SW2.12 SW2.13 SW2.14 SW2.15 SW2.16

### Notes on the sheet
- 8/A Option Board 2
- D-CS-M8317-YB-1 | S

## Power pins joined to a net without a drawn wire
GND: E1.7(P:GND) E2.7(P:GND) E3.7(P:GND) E4.7(P:GND) E5.8(GND) E6.8(P:GND) E7.7(GND) E8.8(GND) E9.7(P:GND) E10.8(GND) E11.8(P:GND) E12.7(P:GND) E13.7(P:GND) E14.8(GND) E15.8(GND) E16.8(GND) E17.8(GND) E18.8(P:GND) E19.8(GND) E20.8(GND) E21.8(P:GND) E22.1(GND) E23.7(P:GND) E24.7(P:GND) E25.8(GND) E26.7(P:GND) E27.7(P:GND) E28.7(P:GND) E29.7(P:GND) E30.8(GND) E31.7(P:GND) E32.7(P:GND) E33.7(P:GND) E34.7(P:GND) E35.8(GND) E36.8(P:GND) E37.7(P:GND) E38.7(P:GND) E39.7(P:GND) E40.8(GND) E41.8(P:GND) E42.7(P:GND) E43.7(P:GND) E44.8(GND) E45.7(P:GND) E46.7(P:GND) E47.7(P:GND) E48.7(P:GND) E49.8(GND) E50.7(P:GND) E51.7(P:GND) E52.7(P:GND) E53.7(P:GND) E54.7(P:GND) E55.7(P:GND) E56.7(P:GND) E57.7(P:GND) E58.7(P:GND) E59.7(P:GND) E60.7(P:GND) E61.8(GND) E62.7(P:GND) E63.7(P:GND) E64.7(P:GND) E65.7(P:GND) E66.7(P:GND) E67.7(P:GND) E68.7(P:GND) E69.7(P:GND) E70.7(P:GND) E71.8(GND) E72.7(P:GND) E73.7(P:GND) E74.7(P:GND) E75.7(P:GND) E76.8(GND) E77.7(P:GND) E78.7(GND) E79.7(P:GND) E80.7(P:GND) E81.8(GND) E82.11(P:GND) E84.7(P:GND) E85.7(GND) E86.8(GND) E87.7(P:GND) E89.7(GND) E90.8(GND) E91.7(P:GND)
VCC: E1.14(P:VCC) E2.14(P:VCC) E3.14(P:VCC) E4.14(P:VCC) E5.16(VCC) E6.16(P:VCC) E7.14(VCC) E8.16(VCC) E9.14(P:VCC) E10.16(VCC) E11.16(P:VCC) E12.14(P:VCC) E13.14(P:VCC) E14.16(VCC) E15.16(VCC) E16.16(VCC) E17.16(VCC) E18.16(P:VCC) E19.16(VCC) E20.16(VCC) E21.16(P:VCC) E22.8(VCC) E23.14(P:VCC) E24.14(P:VCC) E25.16(VCC) E26.14(P:VCC) E27.14(P:VCC) E28.14(P:VCC) E29.14(P:VCC) E30.16(VCC) E31.14(P:VCC) E32.14(P:VCC) E33.14(P:VCC) E34.14(P:VCC) E35.16(VCC) E36.16(P:VCC) E37.14(P:VCC) E38.14(P:VCC) E39.14(P:VCC) E40.16(VCC) E41.16(P:VCC) E42.14(P:VCC) E43.14(P:VCC) E44.16(VCC) E45.14(P:VCC) E46.14(P:VCC) E47.14(P:VCC) E48.14(P:VCC) E49.16(VCC) E50.14(P:VCC) E51.14(P:VCC) E52.14(P:VCC) E53.14(P:VCC) E54.14(P:VCC) E55.14(P:VCC) E56.14(P:VCC) E57.14(P:VCC) E58.14(P:VCC) E59.14(P:VCC) E60.14(P:VCC) E61.16(VCC) E62.14(P:VCC) E63.14(P:VCC) E64.14(P:VCC) E65.14(P:VCC) E66.14(P:VCC) E67.14(P:VCC) E68.14(P:VCC) E69.14(P:VCC) E70.14(P:VCC) E71.16(VCC) E72.14(P:VCC) E73.14(P:VCC) E74.14(P:VCC) E75.14(P:VCC) E76.16(VCC) E77.14(P:VCC) E78.14(VCC) E79.14(P:VCC) E80.14(P:VCC) E81.16(VCC) E82.4(P:VCC) E84.14(P:VCC) E85.14(VCC) E86.16(VCC) E87.14(P:VCC) E89.14(VCC) E90.16(VCC) E91.14(P:VCC)

## Library data of the parts
C1-C96 C100 C101 = dec-con:C-US: Capacitors with funky DEC lead spacing.
C97-C99 = dec-con:CPOL-USE20-8AXIAL: A 0.8 inch electrolytic.
E1-E4 = 74xx-us:74*12: Triple 3-input NAND gate, open collector
E5 E10 E15 E25 E44 E49 = 74xx-us:74*173: 4-bit D type REGISTER, 3-state
E6 E11 E18 E21 E36 E41 = dec-con:DS8837: Hex inverting LINE RECEIVER
E7 = dec-con:74*30: 8-input NAND gate
E8 E14 = dec-con:DEC8235: 4-bit data selector
E9 = 74xx-us:74*125: Quad bus BUFFER, 3-state
E12 E26 E33 E34 E53 E77 = 74xx-us:74*11: Triple 3-input AND gate
E13 E63 E65 E79 E80 E84 E87 = 74xx-us:74*74: Dual D type positive edge triggered FLIP FLOP, preset and clear
E16 E76 E81 = dec-con:74S287: 256x4 Bipolar ROM
E17 E40 = 74xx-us:74*42: 4-line to 10-line DECODER (1-of-10)
E19 E20 = 74xx-us:74*257: Quadruple 2-to 1 line data SELECTOR/MULTIPLEXER
E22 = dec-con:SP314: 7-Input NOR gate
E23 E28 E37 E45 E69 E70 E91 = 74xx-us:74*00: Quad 2-input NAND gate
E24 E55 E72 E75 = 74xx-us:74*08: Quad 2-input AND gate
E27 E31 = 74xx-us:74*10: Triple 3-input NAND gate
E29 E73 = 74xx-us:74*27: Triple 3-input NOR gate
E30 = 74xx-us:74*153: Dual 4-line to 1-line data SELECTOR/MULTIPLEXER
E32 E42 E43 E54 E59 E66 E68 = 74xx-us:74*04: Hex INVERTER
E35 = dec-con:74S288: 32x8 Bipolar ROM
E38 E60 E62 = 74xx-us:74*02: Quad 2-input NOR gate
E39 E50 = dec-con:74*20: Dual 4-input NAND gate
E46 E47 E51 E56-E58 = dec-con:N8881: Quad 2-input NAND gate, open collector
E48 E52 = 74xx-us:74*17: Hex INVERTER, open collector, high-voltage
E61 E71 = 74xx-us:74*175: Qadruple D type FLIP FLOP, clear
E64 E67 E74 = 74xx-us:74*37: Quad 2-input NAND buffer
E78 = 74xx-us:74*164: 8-bit parallel out SHIFT REGISTER
E82 = 74xx-us:74*73: Dual J-K FLIP FLOP, clear
E83 E88 E92 E93 = ic-package:DIL16: Dual In Line / Socket
E85 E89 = dec-con:74LS197: Loadable decade counter
E86 E90 = dec-con:8266: Quad 2-1 selector
Q1-Q3 = transistor:*-NPN-: NPN Transistror BF959 corrected 2008.03.06
R1-R54 = rcl:R-US_: RESISTOR, American symbol
SW1 SW2 = switch-dil:DIP08S: DIL/CODE SWITCH; OC_FARNELL: unknown; OC_NEWARK: unknown
U$1 = dec-con:HEX: Hex-Height DEC Edge Connector
U$2 = dec-con:OUTLINE-*: Board outlines for DEC boards.